# Altium schematic sheet Ethernet.SchDoc: STM324x9I-EVAL Ethernet
size A4; DocumentNumber: 8; Revision: B.3; SheetNumber: 8; SheetTotal: 17
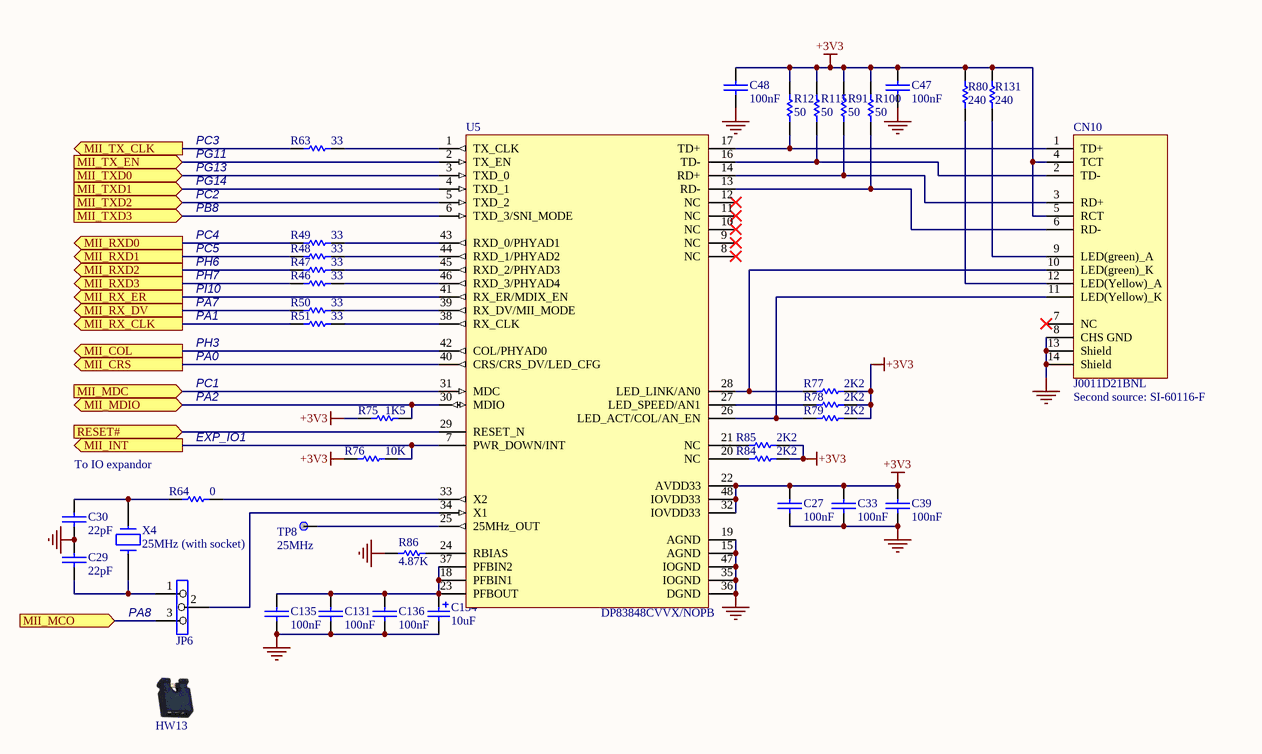
[diagram p0: Ethernet.SchDoc]

## Parts
C27  100nF  [0603C]
C29  22pF  [0603C]
C30  22pF  [0603C]
C33  100nF  [0603C]
C39  100nF  [0603C]
C47  100nF  [0603C]
C48  100nF  [0603C]
C131  100nF  [0603C]
C134  10uF  [TAN-A]
C135  100nF  [0603C]
C136  100nF  [0603C]
CN10  J0011D21BNL  [RJ45_J0011D01BNL]
HW13  JUMPER_OPEN  (value not drawn)
JP6  (no value)  [SIP3]
R46  33  [0603R]
R47  33  [0603R]
R48  33  [0603R]
R49  33  [0603R]
R50  33  [0603R]
R51  33  [0603R]
R63  33  [0603R]
R64  0  [0603R]
R75  1K5  [0603R]
R76  10K  [0603R]
R77  2K2  [0603R]
R78  2K2  [0603R]
R79  2K2  [0603R]
R80  240  [0603R]
R84  2K2  [0603R]
R85  2K2  [0603R]
R86  4.87K  [0603R]
R91  50  [0603R]
R100  50  [0603R]
R115  50  [0603R]
R121  50  [0603R]
R131  240  [0603R]
TP8  25MHz  [TP]
U5  DP83848CVVX/NOPB  [LQFP48_0R5_9X9]
X4  25MHz (with socket)  [XTAL_socket]

## Ports
MII_COL (out), MII_CRS (out), MII_INT (out), MII_MCO (in), MII_MDC (in), MII_MDIO (bidir), MII_RX_CLK (out), MII_RX_DV (out), MII_RX_ER (out), MII_RXD0 (out), MII_RXD1 (out), MII_RXD2 (out), MII_RXD3 (out), MII_TX_CLK (out), MII_TX_EN (in), MII_TXD0 (in), MII_TXD1 (in), MII_TXD2 (in), MII_TXD3 (in), RESET# (in)

## Nets
+3V3: C27.1 C33.2 C39.2 C47.2 C48.2 CN10.4(TCT) CN10.5(RCT) R75.2 R76.1 R77.2 R78.2 R79.2 R80.2 R84.2 R85.2 R91.1 R100.1 R115.1 R121.1 R131.2 U5.22(AVDD33) U5.32(IOVDD33) U5.48(IOVDD33)
GND: C27.2 C29.2 C30.1 C33.1 C39.1 C47.1 C48.1 C131.1 C134.2 C135.2 C136.1 CN10.8(CHS_GND) CN10.13(Shield) CN10.14(Shield) R86.1 U5.15(AGND) U5.19(AGND) U5.35(IOGND) U5.36(DGND) U5.47(IOGND)
MII_COL: U5.42(COL/PHYAD0) ; port MII_COL
MII_CRS: U5.40(CRS/CRS_DV/LED_CFG) ; port MII_CRS
MII_INT: R76.2 U5.7(PWR_DOWN/INT) ; port MII_INT
MII_MCO: JP6.3 ; port MII_MCO
MII_MDC: U5.31(MDC) ; port MII_MDC
MII_MDIO: R75.1 U5.30(MDIO) ; port MII_MDIO
MII_RX_CLK: R51.2 ; port MII_RX_CLK
MII_RX_DV: R50.2 ; port MII_RX_DV
MII_RX_ER: U5.41(RX_ER/MDIX_EN) ; port MII_RX_ER
MII_RXD0: R49.2 ; port MII_RXD0
MII_RXD1: R48.2 ; port MII_RXD1
MII_RXD2: R47.2 ; port MII_RXD2
MII_RXD3: R46.2 ; port MII_RXD3
MII_TX_CLK: R63.2 ; port MII_TX_CLK
MII_TX_EN: U5.2(TX_EN) ; port MII_TX_EN
MII_TXD0: U5.3(TXD_0) ; port MII_TXD0
MII_TXD1: U5.4(TXD_1) ; port MII_TXD1
MII_TXD2: U5.5(TXD_2) ; port MII_TXD2
MII_TXD3: U5.6(TXD_3/SNI_MODE) ; port MII_TXD3
RESET#: U5.29(RESET_N) ; port RESET#
NetC29_1: C29.1 JP6.1 X4.1
NetC30_2: C30.2 R64.2 X4.2
NetC131_2: C131.2 C134.1 C135.1 C136.2 U5.18(PFBIN1) U5.23(PFBOUT) U5.37(PFBIN2)
NetCN10_1: CN10.1(TD+) R121.2 U5.17(TD+)
NetCN10_2: CN10.2(TD-) R115.2 U5.16(TD-)
NetCN10_3: CN10.3(RD+) R91.2 U5.14(RD+)
NetCN10_6: CN10.6(RD-) R100.2 U5.13(RD-)
NetCN10_9: CN10.9(LED(green)_A) R131.1
NetCN10_10: CN10.10(LED(green)_K) R77.1 U5.28(LED_LINK/AN0)
NetCN10_11: CN10.11(LED(Yellow)_K) R79.1 U5.26(LED_ACT/COL/AN_EN)
NetCN10_12: CN10.12(LED(Yellow)_A) R80.1
NetJP6_2: JP6.2 U5.34(X1)
NetR46_1: R46.1 U5.46(RXD_3/PHYAD4)
NetR47_1: R47.1 U5.45(RXD_2/PHYAD3)
NetR48_1: R48.1 U5.44(RXD_1/PHYAD2)
NetR49_1: R49.1 U5.43(RXD_0/PHYAD1)
NetR50_1: R50.1 U5.39(RX_DV/MII_MODE)
NetR51_1: R51.1 U5.38(RX_CLK)
NetR63_1: R63.1 U5.1(TX_CLK)
NetR64_1: R64.1 U5.33(X2)
NetR78_1: R78.1 U5.27(LED_SPEED/AN1)
NetR84_1: R84.1 U5.20(NC)
NetR85_1: R85.1 U5.21(NC)
NetR86_2: R86.2 U5.24(RBIAS)
NetTP8_1: TP8.1 U5.25(25MHz_OUT)

Not connected (* = marked no-connect by the designer): CN10 7(NC)*; U5 8(NC)* 9(NC)* 10(NC)* 11(NC)* 12(NC)*

## Notes on the sheet
- PC3
- PG11
- PG13
- PG14
- PC2
- PB8
- PC4
- PC5
- PH6
- PH7
- PI10
- PA7
- PH3
- PA1
- PA0
- PC1
- PA2
- (near CN10) Second source: SI-60116-F
- To IO expandor
- EXP_IO1
- (near JP6) PA8
- Title:
- Project:
- Size:
- Revision:
- Variant:
- A4
- -
- Date:
- Reference:
- Sheet:
- of

## Library data of the parts
C27 C29 C30 C33 C39 C47 C48 C131 C135 C136 = CAP: Capacitor
C134 = Cap Pol1: Polarized Capacitor (Radial); Published: 8-Jun-2000; Revision: July-2002: Re-released for DXP Platform.; Publisher: Altium Limited; Value: 10uF
CN10 = J0011D21B: RJ45_connector, 8 pins, 1.27mm, RA, TH, Height 17.13mm
JP6 = Jumper3
R46-R51 R63 R64 R75-R80 R84-R86 R91 R100 R115 R121 R131 = Res1: Resistor; Value: 1K; Published: 8-Jun-2000; Revision: July-2002: Re-released for DXP Platform.; Publisher: Altium Limited
TP8 = TP
U5 = DP83848CVV: Transceiver, DP83848C/I/VYB/YB PHYTER™ QFP Single Port 10/100 Mb/s Ethernet Physical Layer Transceiver
X4 = CRYSTAL